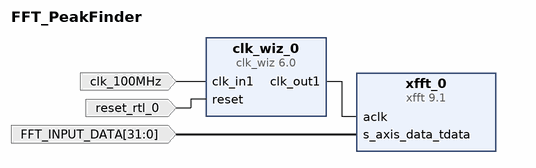
[diagram p0: block diagram of the top level]
# Vivado block design FFT_PeakFinder, xc7vx485tffg1157-1, Vivado 2023.1
create_bd_design FFT_PeakFinder

create_bd_port -dir I -type clk clk_100MHz
set_property -dict {CONFIG.FREQ_HZ 100000000} [get_bd_ports clk_100MHz]
create_bd_port -dir I -type rst reset_rtl_0
set_property -dict {CONFIG.POLARITY ACTIVE_HIGH} [get_bd_ports reset_rtl_0]
create_bd_port -dir I -from 31 -to 0 FFT_INPUT_DATA

create_bd_cell -type ip -vlnv xilinx.com:ip:xfft:9.1 xfft_0
create_bd_cell -type ip -vlnv xilinx.com:ip:clk_wiz:6.0 clk_wiz_0

# ---- connections ----

connect_bd_net [get_bd_ports FFT_INPUT_DATA] [get_bd_pins xfft_0/s_axis_data_tdata]
connect_bd_net [get_bd_ports clk_100MHz] [get_bd_pins clk_wiz_0/clk_in1]
connect_bd_net [get_bd_pins clk_wiz_0/clk_out1] [get_bd_pins xfft_0/aclk]
connect_bd_net -net reset_rtl_0_1 [get_bd_ports reset_rtl_0] [get_bd_pins clk_wiz_0/reset]

validate_bd_design
save_bd_design
